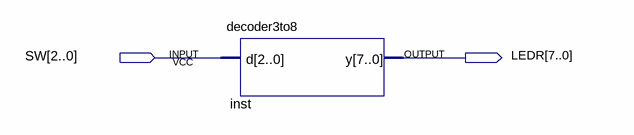
[diagram p0: schematic sheet]
// Quartus schematic block_decoder3to8.bdf as structural Verilog: 1 symbols, 2 pins
module block_decoder3to8 (
  input  [2:0] SW,
  output [7:0] LEDR
);

  decoder3to8 inst (.d(SW), .y(LEDR));
endmodule
